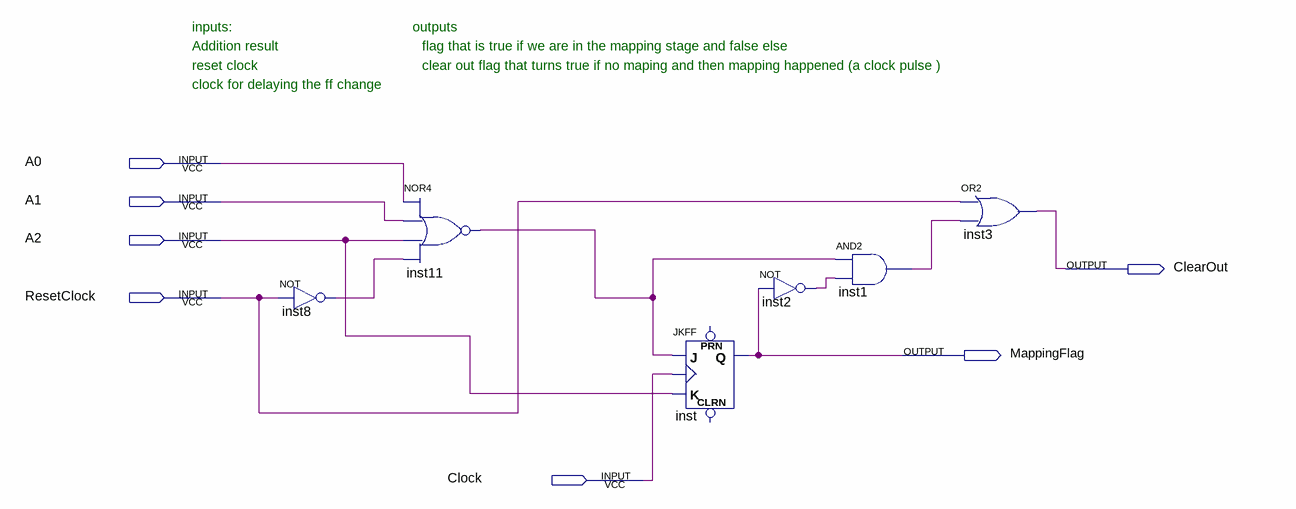
[diagram p0: schematic sheet]
// Quartus schematic MappingStageFlag.bdf as structural Verilog: 6 symbols, 7 pins
module MappingStageFlag (
  input  A0,
  input  A1,
  input  A2,
  input  ResetClock,
  input  Clock,
  output ClearOut,
  output MappingFlag
);

  wire inst1_out, inst2_out, inst8_out, inst11_out;

  not inst8 (inst8_out, ResetClock);
  nor inst11 (inst11_out, A0, A1, A2, inst8_out);
  JKFF inst (.K(A2), .J(inst11_out), .CLK(Clock), .Q(MappingFlag));  // open: PRN, CLRN
  not inst2 (inst2_out, MappingFlag);
  and inst1 (inst1_out, inst11_out, inst2_out);
  or inst3 (ClearOut, ResetClock, inst1_out);

  // Notes on the sheet:
  //   inputs:
  //   outputs
  //   Addition result
  //   flag that is true if we are in the mapping stage and false else
  //   reset clock
  //   clear out flag that turns true if no maping and then mapping happened (a clock pulse )
  //   clock for delaying the ff change
endmodule
